# EAGLE design 140703_AriloTX_REV2_1_0 (EAGLE 6.5.0)
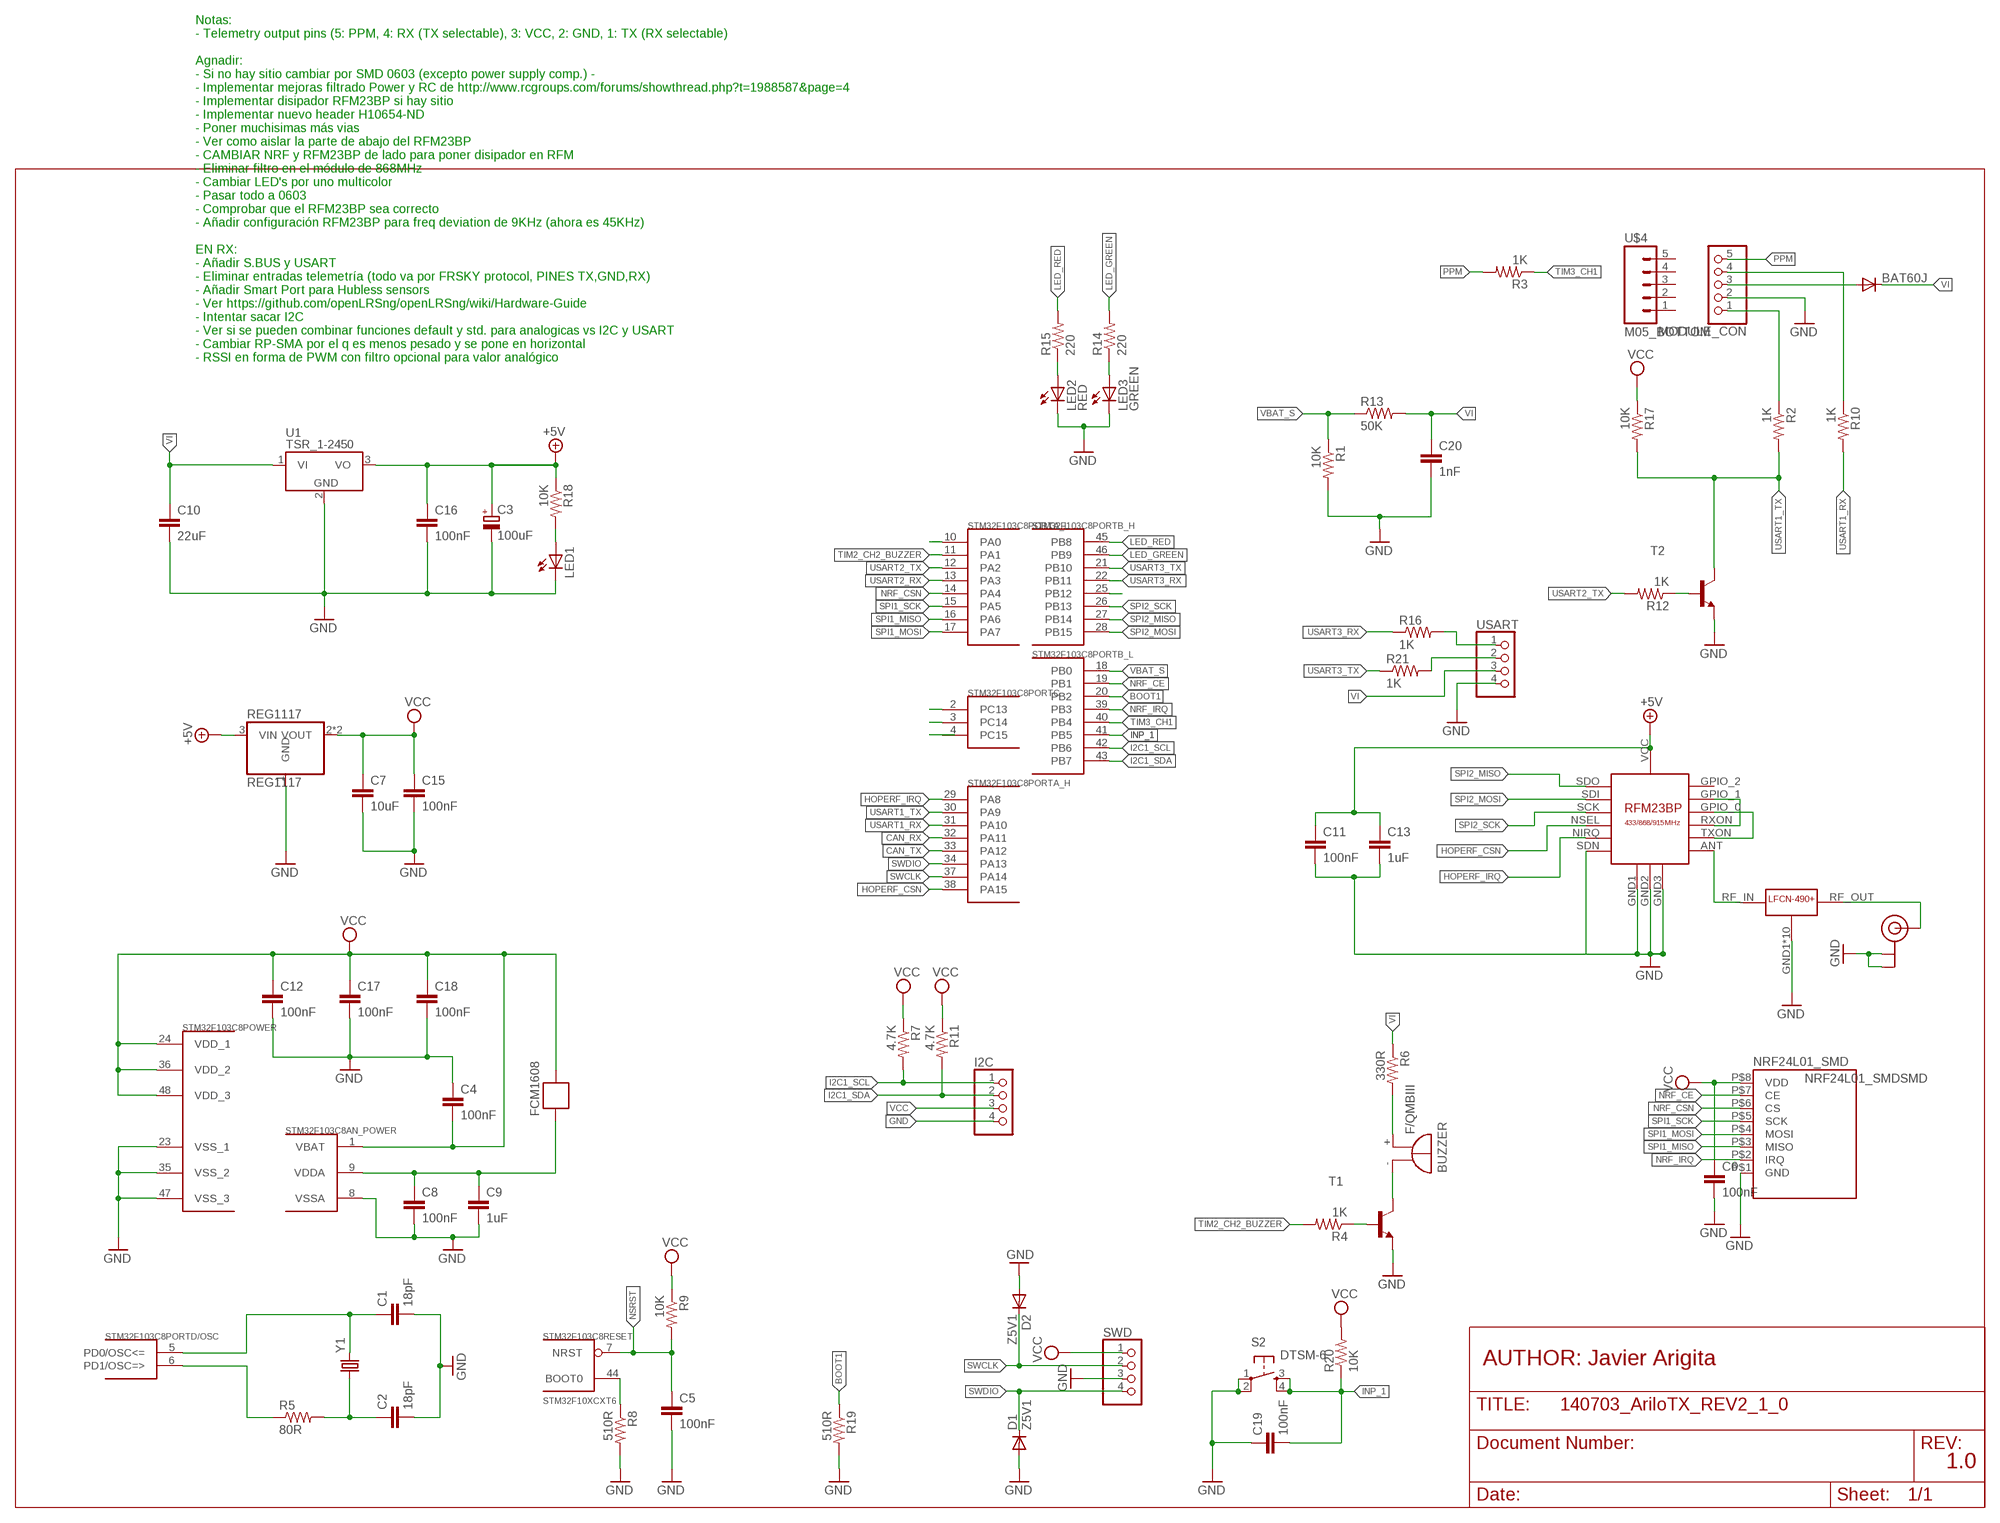
[diagram p0: schematic, sheet 1]

## Parts
BAT60J  DIODE-SOD323-R  [SOD323-R]
BUZZER  F/QMBIII  [F/QMBIII]
C1  18pF  C-EUC0805  [C0805]
C2  18pF  C-EUC0805  [C0805]
C3  100uF  CPOL-EUSMCB  [SMC_B]
C4  100nF  C-EUC0805  [C0805]
C5  100nF  C-EUC0805  [C0805]
C6  100nF  C-EUC0805  [C0805]
C7  10uF  C-EUC0805  [C0805]
C8  100nF  C-EUC0805  [C0805]
C9  1uF  C-EUC3216  [C3216]
C10  22uF  C-EUC3216  [C3216]
C11  100nF  C-EUC0805  [C0805]
C12  100nF  C-EUC0805  [C0805]
C13  1uF  C-EUC3216  [C3216]
C15  100nF  C-EUC0805  [C0805]
C16  100nF  C-EUC0805  [C0805]
C17  100nF  C-EUC0805  [C0805]
C18  100nF  C-EUC0805  [C0805]
C19  100nF  C-EUC0805  [C0805]
C20  1nF  C-EUC0805  [C0805]
D1  Z5V1  DIODE-SOD323-R  [SOD323-R]
D2  Z5V1  DIODE-SOD323-R  [SOD323-R]
FCM1608  FERRITE-BEAD  [R0603]
I2C  PINHD-1X4  [1X04]
LED1  LED0805  [CHIPLED_0805]
LED2  RED  LEDCHIP-LED0805  [CHIP-LED0805]
LED3  GREEN  LEDCHIP-LED0805  [CHIP-LED0805]
MODULE_CON  PINHD-1X5  [1X05]
NRF24L01_SMD  NRF24L01_SMDSMD  [NRF24L01_SMD]
R1  10K  RESISTOR0805  [R0805]
R2  1K  RESISTOR0805  [R0805]
R3  1K  RESISTOR0805  [R0805]
R4  1K  RESISTOR0805  [R0805]
R5  80R  RESISTOR0805  [R0805]
R6  330R  RESISTOR0805  [R0805]
R7  4.7K  RESISTOR0805  [R0805]
R8  510R  RESISTOR0805  [R0805]
R9  10K  RESISTOR0805  [R0805]
R10  1K  RESISTOR0805  [R0805]
R11  4.7K  RESISTOR0805  [R0805]
R12  1K  RESISTOR0805  [R0805]
R13  50K  RESISTOR0805  [R0805]
R14  220  RESISTOR0805  [R0805]
R15  220  RESISTOR0805  [R0805]
R16  1K  RESISTOR0805  [R0805]
R17  10K  RESISTOR0805  [R0805]
R18  10K  RESISTOR0805  [R0805]
R19  510R  RESISTOR0805  [R0805]
R20  10K  RESISTOR0805  [R0805]
R21  1K  RESISTOR0805  [R0805]
REG1117  REG1117  [SOT223]
S2  DTSM-6  [DTSM-6]
STM32F103C8  STM32F10XCXT6  [TQFP48]
SWD  PINHD-1X4  [1X04]
T1  BC848-NPN-SOT23-BEC  [SOT23-BEC]
T2  BC848-NPN-SOT23-BEC  [SOT23-BEC]
U1  TSR_1-2450  [TSR-1]
U$1  RFM23BP  [RFM23BP]
U$2  LFCN490+  [LFCN490+]
U$3  U.FL  [U.FL]
U$4  M05_BOTTOM  [M05_BOTTOM]
USART  PINHD-1X4  [1X04]
Y1  CRYSTAL5X3  [CRYSTAL-SMD-5X3]

## Nets
+5V: C3.+ C11.1 C13.1 C16.1 R18.1 REG1117.3(VIN) U1.3(VO) U$1.VCC
BOOT1: R19.1 STM32F103C8.20(PORTB_L:PB2)
CAN_RX: STM32F103C8.32(PORTA_H:PA11)
CAN_TX: STM32F103C8.33(PORTA_H:PA12)
GND: C1.2 C2.2 C3.- C4.1 C5.2 C6.2 C7.2 C8.2 C9.2 C10.2 C11.2 C12.2 C13.2 C15.2 C16.2 C17.2 C18.2 C19.1 C20.2 D1.A D2.A I2C.4 LED1.C LED2.C LED3.C MODULE_CON.2 NRF24L01_SMD.P$1(GND) R1.2 R8.2 R19.2 REG1117.1(GND) S2.1 S2.2 STM32F103C8.8(AN_POWER:VSSA) STM32F103C8.23(POWER:VSS_1) STM32F103C8.35(POWER:VSS_2) STM32F103C8.47(POWER:VSS_3) SWD.3 T1.E T2.E U1.2(GND) U$1.GND1 U$1.GND2 U$1.GND3 U$1.SDN U$2.GND1(GND) U$2.GND2(GND) U$2.GND3(GND) U$2.GND4(GND) U$2.GND5(GND) U$2.GND6(GND) U$2.GND7(GND) U$2.GND8(GND) U$2.GND9(GND) U$2.GND10(GND) U$3.P$1(GND) U$3.P$2(GND) USART.4
HOPERF_CSN: STM32F103C8.38(PORTA_H:PA15) U$1.NSEL
HOPERF_IRQ: STM32F103C8.29(PORTA_H:PA8) U$1.NIRQ
I2C1_SCL: I2C.1 R7.2 STM32F103C8.42(PORTB_L:PB6)
I2C1_SDA: I2C.2 R11.2 STM32F103C8.43(PORTB_L:PB7)
INP_1: C19.2 R20.1 S2.3 S2.4 STM32F103C8.41(PORTB_L:PB5)
LED_GREEN: R14.2 STM32F103C8.46(PORTB_H:PB9)
LED_RED: R15.2 STM32F103C8.45(PORTB_H:PB8)
N$1: C1.1 STM32F103C8.5(PORTD/OSC:PD0/OSC<=) Y1.3
N$2: R5.1 STM32F103C8.6(PORTD/OSC:PD1/OSC=>)
N$3: C2.1 R5.2 Y1.1
N$4: R8.1 STM32F103C8.44(RESET:BOOT0)
N$5: R12.1 T2.B
N$6: MODULE_CON.1 R2.1
N$7: LED2.A R15.1
N$8: LED3.A R14.1
N$9: MODULE_CON.4 R10.1
N$10: LED1.A R18.2
N$11: U$1.ANT U$2.RF_IN(RF_INP)
N$12: R16.2 USART.1
N$13: R21.2 USART.2
N$14: BAT60J.A MODULE_CON.3
N$15: STM32F103C8.2(PORTC:PC13)
N$16: BUZZER.+(-) R6.2
N$17: C8.1 C9.1 FCM1608.2 STM32F103C8.9(AN_POWER:VDDA)
N$18: STM32F103C8.3(PORTC:PC14)
N$20: U$2.RF_OUT(RF_OUTP) U$3.P$3(SIGNAL)
N$21: R4.1 T1.B
N$22: STM32F103C8.25(PORTB_H:PB12)
N$23: BUZZER.-(+) T1.C
N$24: STM32F103C8.10(PORTA_L:PA0)
N$25: U$1.GPIO_1 U$1.RXON
N$26: U$1.GPIO_0 U$1.TXON
NRF_CE: NRF24L01_SMD.P$7(CE) STM32F103C8.19(PORTB_L:PB1)
NRF_CSN: NRF24L01_SMD.P$6(CS) STM32F103C8.14(PORTA_L:PA4)
NRF_IRQ: NRF24L01_SMD.P$2(IRQ) STM32F103C8.39(PORTB_L:PB3)
NSRST: C5.1 R9.2 STM32F103C8.7(RESET:NRST)
PPM: MODULE_CON.5 R3.2
SPI1_MISO: NRF24L01_SMD.P$3(MISO) STM32F103C8.16(PORTA_L:PA6)
SPI1_MOSI: NRF24L01_SMD.P$4(MOSI) STM32F103C8.17(PORTA_L:PA7)
SPI1_SCK: NRF24L01_SMD.P$5(SCK) STM32F103C8.15(PORTA_L:PA5)
SPI2_MISO: STM32F103C8.27(PORTB_H:PB14) U$1.SDO
SPI2_MOSI: STM32F103C8.28(PORTB_H:PB15) U$1.SDI
SPI2_SCK: STM32F103C8.26(PORTB_H:PB13) U$1.SCK
SWCLK: D2.C STM32F103C8.37(PORTA_H:PA14) SWD.2
SWDIO: D1.C STM32F103C8.34(PORTA_H:PA13) SWD.4
TIM2_CH2_BUZZER: R4.2 STM32F103C8.11(PORTA_L:PA1)
TIM3_CH1: R3.1 STM32F103C8.40(PORTB_L:PB4)
USART1_RX: R10.2 STM32F103C8.31(PORTA_H:PA10)
USART1_TX: R2.2 R17.2 STM32F103C8.30(PORTA_H:PA9) T2.C
USART2_RX: STM32F103C8.13(PORTA_L:PA3)
USART2_TX: R12.2 STM32F103C8.12(PORTA_L:PA2)
USART3_RX: R16.1 STM32F103C8.22(PORTB_H:PB11)
USART3_TX: R21.1 STM32F103C8.21(PORTB_H:PB10)
VBAT_S: R1.1 R13.1 STM32F103C8.18(PORTB_L:PB0)
VCC: C4.2 C6.1 C7.1 C12.1 C15.1 C17.1 C18.1 FCM1608.1 I2C.3 NRF24L01_SMD.P$8(VDD) R7.1 R9.1 R11.1 R17.1 R20.2 REG1117.2(VOUT) REG1117.4(VOUT) STM32F103C8.1(AN_POWER:VBAT) STM32F103C8.24(POWER:VDD_1) STM32F103C8.36(POWER:VDD_2) STM32F103C8.48(POWER:VDD_3) SWD.1
VI: BAT60J.C C10.1 C20.1 R6.1 R13.2 U1.1(VI) USART.3
Unconnected: STM32F103C8.4(PORTC:PC15) U$1.GPIO_2 U$4.1 U$4.2 U$4.3 U$4.4 U$4.5

## Notes on the sheet
- Notas: 
  - Telemetry output pins (5: PPM, 4: RX (TX selectable), 3: VCC, 2: GND, 1: TX (RX selectable)
  
  Agnadir: 
  - Si no hay sitio cambiar por SMD 0603 (excepto power supply comp.) - 
  - Implementar mejoras filtrado Power y RC de http://www.rcgroups.com/forums/showthread.php?t=1988587&page=4 
  - Implementar disipador RFM23BP si hay sitio
  - Implementar nuevo header H10654-ND
  - Poner muchisimas más vias
  - Ver como aislar la parte de abajo del RFM23BP
  - CAMBIAR NRF y RFM23BP de lado para poner disipador en RFM
  - Eliminar filtro en el módulo de 868MHz
  - Cambiar LED's por uno multicolor
  - Pasar todo a 0603
  - Comprobar que el RFM23BP sea correcto
  - Añadir configuración RFM23BP para freq deviation de 9KHz (ahora es 45KHz)
  
  EN RX:
  - Añadir S.BUS y USART
  - Eliminar entradas telemetría (todo va por FRSKY protocol, PINES TX,GND,RX)
  - Añadir Smart Port para Hubless sensors
  - Ver https://github.com/openLRSng/openLRSng/wiki/Hardware-Guide
  - Intentar sacar I2C
  - Ver si se pueden combinar funciones default y std. para analogicas vs I2C y USART
  - Cambiar RP-SMA por el q es menos pesado y se pone en horizontal
  - RSSI en forma de PWM con filtro opcional para valor analógico
- AUTHOR: Javier Arigita
- 1.0

## Library data of the parts
BAT60J D1 D2 = diode:DIODE-: DIODE
BUZZER = buzzer:F/QMBIII: BUZZER Source: Buerklin; OC_FARNELL: unknown; OC_NEWARK: unknown
C1 C2 C4-C8 C11 C12 C15-C20 = rcl:C-EU: CAPACITOR, European symbol
C3 = rcl:CPOL-EU: POLARIZED CAPACITOR, European symbol
C9 C10 C13 = resistor:C-EU: CAPACITOR, European symbol
FCM1608 = BaseApp:FERRITE-BEAD
I2C SWD USART = pinhead:PINHD-1X4: PIN HEADER
LED1 = CEDT:LED
LED2 LED3 = led:LED: LED OSRAM: - CHIPLED LG R971, LG N971, LY N971, LG Q971, LY Q971, LO R971, LY R971 LH N974, LH R974 LS Q976, LO Q976, LY Q976 LO Q996 - Hyper CHIPLED LW Q18S LB Q993, LB Q99A, LB R99A - SideLED LS A670, LO A670, LY A670, LG A670, LP A670 LB A673, LV A673, LT A673, LW A673 LH A674 LY A675 LS A676, LA A676, LO A676, LY A676, LW A676 LS A679, LY A679, LG A679 - Hyper Micro SIDELED® LS Y876, LA Y876, LO Y876, LY Y876 LT Y87S - SmartLED LW L88C, LW L88S LB L89C, LB L89S, LG L890 LS L89K, LO L89K, LY L89K LS L896, LA L896, LO L896, LY L896 - TOPLED LS T670, LO T670, LY T670, LG T670, LP T670 LSG T670, LSP T670, LSY T670, LOP T670, LYG T670 LG T671, LOG T671, LSG T671 LB T673, LV T673, LT T673, LW T673 LH T674 LS T676, LA T676, LO T676, LY T676, LB T676, LH T676, LSB T676, LW T676 LB T67C, LV T67C, LT T67C, LS T67K, LO T67K, LY T67K, LW E67C LS E67B, LA E67B, LO E67B, LY E67B, LB E67C, LV E67C, LT E67C LW T67C LS T679, LY T679, LG T679 LS T770, LO T770, LY T770, LG T770, LP T770 LB T773, LV T773, LT T773, LW T773 LH T774 LS E675, LA E675, LY E675, LS T675 LS T776, LA T776, LO T776, LY T776, LB T776 LHGB T686 LT T68C, LB T68C - Hyper Mini TOPLED® LB M676 - Mini TOPLED Santana® LG M470 LS M47K, LO M47K, LY M47K Source: http://www.osram.convergy.de LUXEON: - LUMILED® LXK2-PW12-R00, LXK2-PW12-S00, LXK2-PW14-U00, LXK2-PW14-V00 LXK2-PM12-R00, LXK2-PM12-S00, LXK2-PM14-U00 LXK2-PE12-Q00, LXK2-PE12-R00, LXK2-PE12-S00, LXK2-PE14-T00, LXK2-PE14-U00 LXK2-PB12-K00, LXK2-PB12-L00, LXK2-PB12-M00, LXK2-PB14-N00, LXK2-PB14-P00, LXK2-PB14-Q00 LXK2-PR12-L00, LXK2-PR12-M00, LXK2-PR14-Q00, LXK2-PR14-R00 LXK2-PD12-Q00, LXK2-PD12-R00, LXK2-PD12-S00 LXK2-PH12-R00, LXK2-PH12-S00 LXK2-PL12-P00, LXK2-PL12-Q00, LXK2-PL12-R00 Source: www.luxeon.com KINGBRIGHT: KA-3528ASYC Source: www.kingbright.com
MODULE_CON = pinhead:PINHD-1X5: PIN HEADER
NRF24L01_SMD = NRF24L01+:NRF24L01_SMD
R1-R21 = CEDT:RESISTOR
REG1117 = CEDT:REG1117: 800mA and 1A Low Dropout (LDO) Positive Regulator 1.8V, 2.5V, 2.85V, 3.3V, 5V, and Adj
S2 = switch-tact:DTSM-6
STM32F103C8 = stm32:STM32F10XCXT6: ST STM32F101/103 48pin LQFP
T1 T2 = transistor:*-NPN-: NPN Transistror BF959 corrected 2008.03.06
U1 = _hhn_traco_tsr-1:TSR_1-*: TRACO TSR-1 Series Point-of-Load DC/DC-Converters Vi max. 36 V; Vo = (1.2 .. 15)V ±2%; Io = 0 .. 1 A SIP-Package (drop-in replacement for 78xx linear voltage regulators in TO220-package, vertically assembled) Source: www.tracopower.com Technologies: TSR 1- Vi (V) Vo (V) ±2% Io = 0 .. 1 A 24_ ( generic ) 2412 4.6 .. 36 1.2 2415 4.6 .. 36 1.5 2418 4.6 .. 36 1.8 2425 4.6 .. 36 2.5 2433 4.75.. 36 3.3 2450 6.5 .. 36 5.0 2465 9.0 .. 36 6.5 2490 12 .. 36 9.0 24120 15 .. 36 12 24150 18 .. 36 15 Author: Dipl.-Ing. FH Rainer Bayer HHN Hochschule Heilbronn, rainer.bayer@hs-heilbronn.de Ingenieurbüro ing-rb, mail@ing-rb.de
U$1 = RFM23BP:RFM23BP: HopeRF RFM23BP Library by: http://projects.weber-itam.de
U$2 = RFM23BP:LFCN490+
U$3 = SparkFun-Connectors:U.FL: SMD antenna connector- WRL-09144
U$4 = RFM23BP_new:M05_BOTTOM
Y1 = SparkFun-FreqCtrl:CRYSTAL: Various standard crystals. Proven footprints. Spark Fun Electronics SKU : COM-00534

## Board
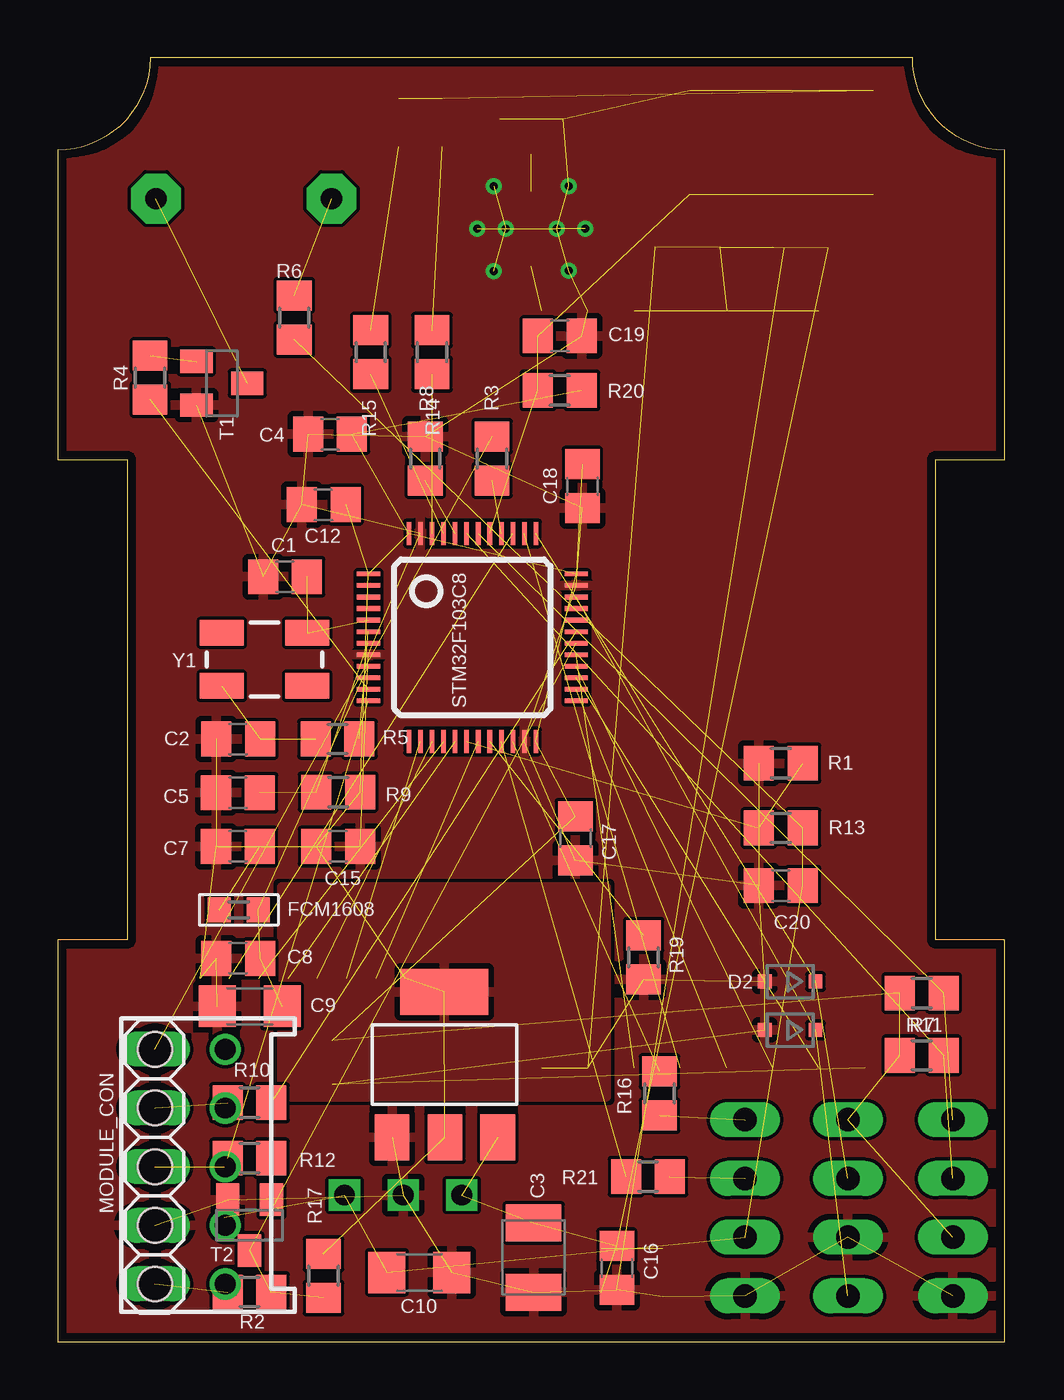
[diagram p1: board, top side]
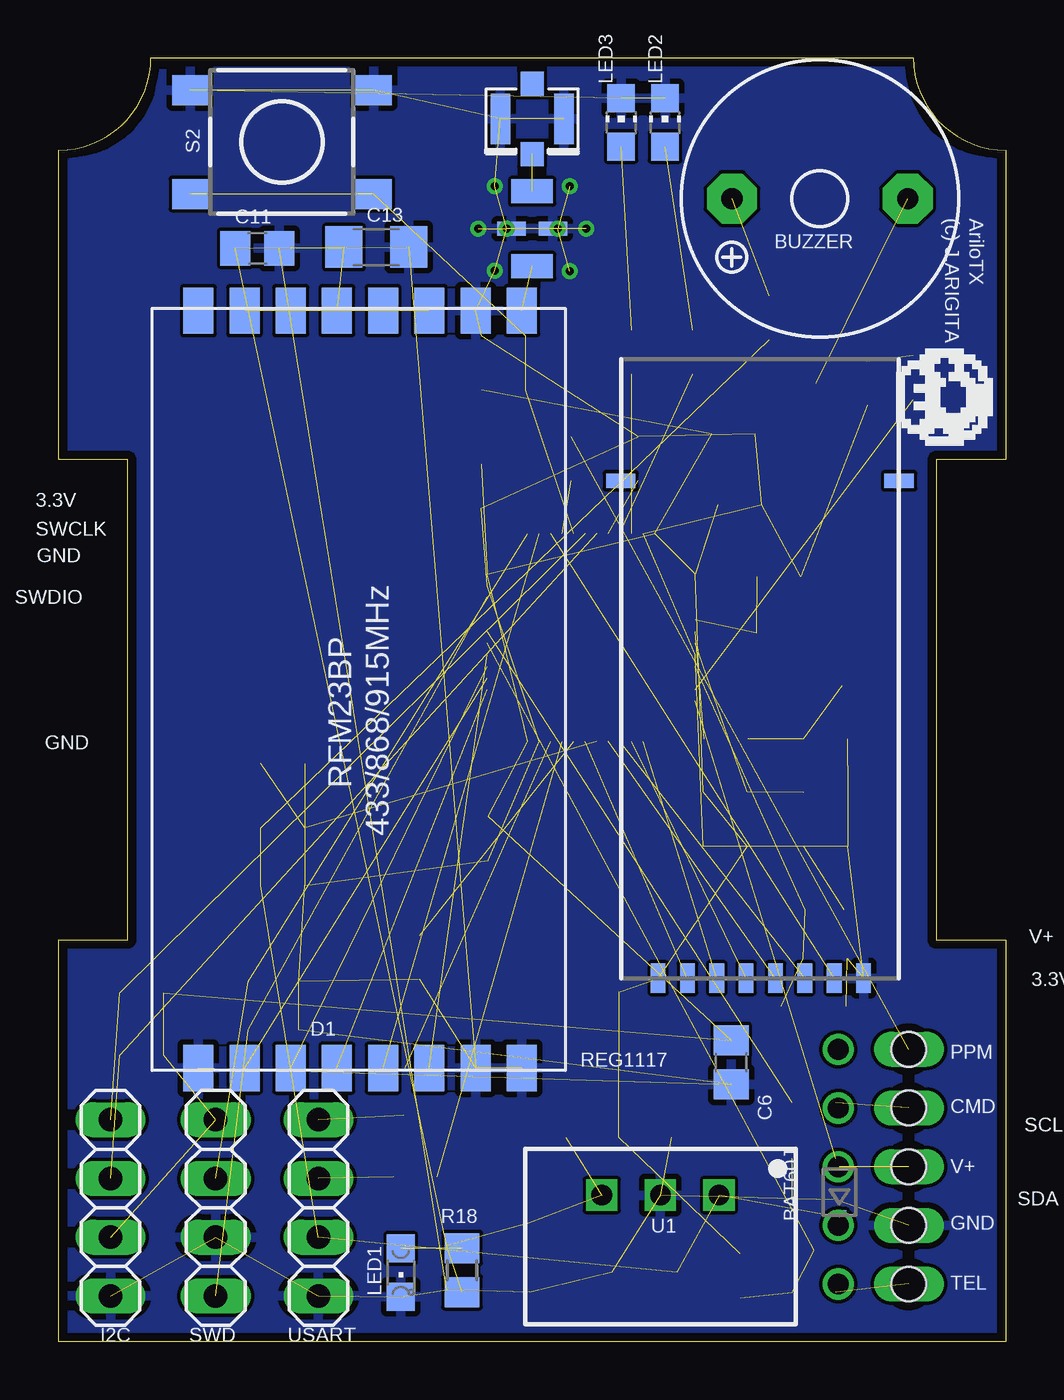
[diagram p2: board, bottom side, seen from below]

Size 41 x 55.6 mm. Coordinates in mm from the lower left corner, seen from the top.
Outline: 0,0 41,0 41,17.4 38,17.4 38,38.2 41,38.2 41,51.6 arc-90 37,55.6 4,55.6 arc-90 0,51.6 0,38.2 3,38.2 3,17.4 0,17.4 0,0
Copper layers (1*16): Top 0.0356mm / dielectric 1.5011mm / Bottom 0.0356mm
Design rules "default": minimum track width 6mil, minimum drill 13mil, track to track 6mil, track to pad 6mil, pad to pad 6mil, via to via 6mil, smd to smd 6mil, copper to edge 15mil, drill to drill 6mil, minimum pad ring 7mil, minimum via ring 7mil, stop-mask expansion 4mil, vias tented up to drill 0mil, thermal gap 10mil

### Footprints (pad centres in the part's own frame; a part is rotated, then mirrored left to right if it is on the bottom)
SOD323-R = smd 0.6 x 0.6: A 1.1,0; C -1.1,0
F/QMBIII = drill 0.914 pad 2.159 octagon: + 3.8,0; - -3.8,0
C0805 = smd 1.3 x 1.5: 1 -0.95,0; 2 0.95,0
SMC_B = smd 1.6 x 2.4: + -1.5,0; - 1.5,0
C3216 = smd 1.6 x 1.8: 1 -1.4,0; 2 1.4,0
R0603 = smd 1 x 1.1: 1 -0.85,0; 2 0.85,0
1X04 = drill 1.016 long: 1 -3.81,0; 2 -1.27,0; 3 1.27,0; 4 3.81,0
CHIPLED_0805 = smd 1.2 x 1.2: A 0,-1.05; C 0,1.05
CHIP-LED0805 = smd 1.2 x 1.2: A 0,-1.05; C 0,1.05
1X05 = drill 1.016 long: 1 -5.08,0; 2 -2.54,0; 3 0,0; 4 2.54,0; 5 5.08,0
NRF24L01_SMD = smd 1.27 x 0.635: P$1 26.807,10.492; P$2 26.807,9.222; P$3 26.807,7.952; P$4 26.807,6.682; P$5 26.807,5.412; P$6 26.807,4.142; P$7 26.807,2.872; P$8 26.807,1.602 | smd 0.635 x 1.27: P$11 5.267,-0.018; P$13 5.267,12.032
R0805 = smd 1.3 x 1.5: 1 -0.95,0; 2 0.95,0
SOT223 = smd 1.499 x 2.007: 1 -2.261,-3.15; 2 0.025,-3.15; 3 2.311,-3.15 | smd 3.81 x 2.007: 4 0,3.15
DTSM-6 = smd 1.55 x 1.3: 1 -3.975,2.25; 2 3.975,2.25; 3 -3.975,-2.25; 4 3.975,-2.25
TQFP48 = smd 0.2 x 1: 1 -2.75,-4.5; 2 -2.25,-4.5; 3 -1.75,-4.5; 4 -1.25,-4.5; 5 -0.75,-4.5; 6 -0.25,-4.5; 7 0.25,-4.5; 8 0.75,-4.5; 9 1.25,-4.5; 10 1.75,-4.5; 11 2.25,-4.5; 12 2.75,-4.5; 25 2.75,4.5; 26 2.25,4.5; 27 1.75,4.5; 28 1.25,4.5; 29 0.75,4.5; 30 0.25,4.5; 31 -0.25,4.5; 32 -0.75,4.5; 33 -1.25,4.5; 34 -1.75,4.5; 35 -2.25,4.5; 36 -2.75,4.5 | smd 1 x 0.2: 13 4.5,-2.75; 14 4.5,-2.25; 15 4.5,-1.75; 16 4.5,-1.25; 17 4.5,-0.75; 18 4.5,-0.25; 19 4.5,0.25; 20 4.5,0.75; 21 4.5,1.25; 22 4.5,1.75; 23 4.5,2.25; 24 4.5,2.75; 37 -4.5,2.75; 38 -4.5,2.25; 39 -4.5,1.75; 40 -4.5,1.25; 41 -4.5,0.75; 42 -4.5,0.25; 43 -4.5,-0.25; 44 -4.5,-0.75; 45 -4.5,-1.25; 46 -4.5,-1.75; 47 -4.5,-2.25; 48 -4.5,-2.75
SOT23-BEC = smd 1 x 1.4: B -0.95,-1.1; C 0,1.1; E 0.95,-1.1
TSR-1 = drill 0.9 square: 1 -2.54,0; 2 0,0; 3 2.54,0
RFM23BP = smd 2 x 1.3: ANT 16.9,-7.5; GND1 -15.9,6.5; GND2 -15.9,-7.5; GND3 16.9,-5.5; GPIO_0 16.9,2.5; GPIO_1 16.9,4.5; GPIO_2 16.9,6.5; NIRQ -15.9,-3.5; NSEL -15.9,-1.5; RXON 16.9,-1.5; SCK -15.9,0.5; SDI -15.9,2.5; SDN -15.9,-5.5; SDO -15.9,4.5; TXON 16.9,-3.5; VCC 16.9,0.5
LFCN490+ = drill 0.34 pad 0.61: GND1 0.326,2.526; GND2 2.145,3.237; GND3 3.984,2.526; GND4 2.145,2.005; GND7 2.145,-0.205; GND8 0.316,-0.726; GND9 2.145,-1.437; GND10 3.984,-0.726 | smd 0.61 x 1.245: GND5 2.145,1.8; GND6 2.145,0 | smd 1.04 x 1.8: RF_IN 0.52,0.9; RF_OUT 3.77,0.9
U.FL = smd 2.2 x 0.85: P$1 0,1.375; P$2 0,-1.375 | smd 1.05 x 1: P$3 1.525,0; P$4 -1.525,0
M05_BOTTOM = drill 0.9: 1 -5.1,-1.5; 2 -2.56,-1.5; 3 -0.02,-1.5; 4 2.52,-1.5; 5 5.06,-1.5 | hole 1.5: -5.1,1.54; -2.56,1.54; -0.02,1.54; 2.52,1.54; 5.06,1.54
CRYSTAL-SMD-5X3 = smd 1.9 x 1.1: 1 -1.85,-1.15; 2 1.85,-1.15; 3 1.85,1.15; 4 -1.85,1.15

### Placement (x,y rotation side)
BAT60J  7.2,6.48 90 bottom
BUZZER  8.05,49.5 180 bottom
C1  9.84,33.12 180 top
C2  7.81,26.1 180 top
C3  20.6,3.65 270 top
C4  11.79,39.3 0 top
C5  7.8,23.77 180 top
C6  11.88,12.1 270 bottom
C7  7.8,21.45 180 top
C8  7.81,16.6 180 top
C9  8.31,14.53 180 top
C10  15.65,3 0 top
C11  32.4,47.35 0 bottom
C12  11.51,36.25 180 top
C13  27.25,47.4 0 bottom
C15  12.13,21.45 0 top
C16  24.2,3.2 270 top
C17  22.41,21.8 270 top
C18  22.71,37.05 270 top
C19  21.73,43.55 180 top
C20  31.3,19.75 180 top
D1  31.7,13.5 180 top
D2  31.7,15.6 180 top
FCM1608  7.83,18.7 0 top
I2C  38.75,5.8 270 bottom
LED1  26.18,3 180 bottom
LED2  14.75,52.8 0 bottom
LED3  16.65,52.8 0 bottom
MODULE_CON  4.19,7.58 90 top
NRF24L01_SMD  16.65,42.55 270 bottom
R1  31.3,25.05 180 top
R2  8.3,2.15 0 top
R3  18.8,38.25 90 top
R4  4,41.75 270 top
R5  12.11,26.1 180 top
R6  10.23,44.35 90 top
R7  37.4,15.1 0 top
R8  15.91,38.25 90 top
R9  12.13,23.8 180 top
R10  8.3,10.35 0 top
R11  37.4,12.4 0 top
R12  8.3,7.95 180 top
R13  31.3,22.25 0 top
R14  16.2,42.85 270 top
R15  13.55,42.85 270 top
R16  26.05,10.75 270 top
R17  11.5,2.85 270 top
R18  23.54,3.1 90 bottom
R19  25.36,16.65 270 top
R20  21.73,41.2 0 top
R21  25.55,7.15 0 top
REG1117  16.73,12 0 top
S2  31.34,51.95 0 bottom
STM32F103C8  17.95,30.5 270 top
SWD  34.2,5.8 270 bottom
T1  7.1,41.5 270 top
T2  8.3,5.05 180 top
U1  14.95,6.35 180 bottom
U$1  28.45,27.75 90 bottom
U$2  19.6,46.05 90 bottom
U$3  20.5,52.95 270 bottom
U$4  5.75,7.6 90 top
USART  29.75,5.8 270 bottom
Y1  8.95,29.55 0 top

### Tracks (layer width: path | path; a pad name or v marks a point on that pad's centre or on a via)
+5V  (7 unrouted)
BOOT1  (1 unrouted)
GND  (57 unrouted)
  pour Top (rank 2): 40.5,16.9 37.5,17 37.5,38.7 40.5,38.7 40.5,51.1 arc-90 36.5,55.1 4.5,55.1 arc-90 0.5,51.1 0.5,38.7 3.5,38.7 3.5,16.9 0.5,16.9 0.5,0.5 40.5,0.5
  pour Bottom (rank 2): 40.5,16.9 37.5,17 37.5,38.7 40.5,38.7 40.5,51.1 arc-90 36.5,55.1 4.5,55.1 arc-90 0.5,51.1 0.5,38.7 3.5,38.7 3.5,16.9 0.5,16.9 0.5,0.5 40.5,0.5
HOPERF_CSN  (1 unrouted)
HOPERF_IRQ  (1 unrouted)
I2C1_SCL  (2 unrouted)
I2C1_SDA  (2 unrouted)
INP_1  (4 unrouted)
LED_GREEN  (1 unrouted)
LED_RED  (1 unrouted)
N$1  (2 unrouted)
N$2  (1 unrouted)
N$3  (2 unrouted)
N$4  (1 unrouted)
N$5  (1 unrouted)
N$6  (1 unrouted)
N$7  (1 unrouted)
N$8  (1 unrouted)
N$9  (1 unrouted)
N$10  (1 unrouted)
N$11  (1 unrouted)
N$12  (1 unrouted)
N$13  (1 unrouted)
N$14  (1 unrouted)
N$16  (1 unrouted)
N$17  (3 unrouted)
N$20  (1 unrouted)
N$21  (1 unrouted)
N$23  (1 unrouted)
N$25  (1 unrouted)
N$26  (1 unrouted)
NRF_CE  (1 unrouted)
NRF_CSN  (1 unrouted)
NRF_IRQ  (1 unrouted)
NSRST  (2 unrouted)
PPM  (1 unrouted)
SPI1_MISO  (1 unrouted)
SPI1_MOSI  (1 unrouted)
SPI1_SCK  (1 unrouted)
SPI2_MISO  (1 unrouted)
SPI2_MOSI  (1 unrouted)
SPI2_SCK  (1 unrouted)
SWCLK  (2 unrouted)
SWDIO  (2 unrouted)
TIM2_CH2_BUZZER  (1 unrouted)
TIM3_CH1  (1 unrouted)
USART1_RX  (1 unrouted)
USART1_TX  (3 unrouted)
USART2_TX  (1 unrouted)
USART3_RX  (1 unrouted)
USART3_TX  (1 unrouted)
VBAT_S  (2 unrouted)
VCC  (21 unrouted)
  pour Top: 23.75,10.6 9.7,10.6 9.7,19.7 23.75,19.7
VI  (6 unrouted)

### Text on the board
bPlace: AriloTX | (c) J.ARIGITA | 3.3V | SWCLK | GND | SWDIO | GND | V+ | 3.3V | PPM | CMD | SCL | V+ | SDA | GND | GND | 3.3V | TEL